# EAGLE schematic Stencil Test (EAGLE 6.6.0)
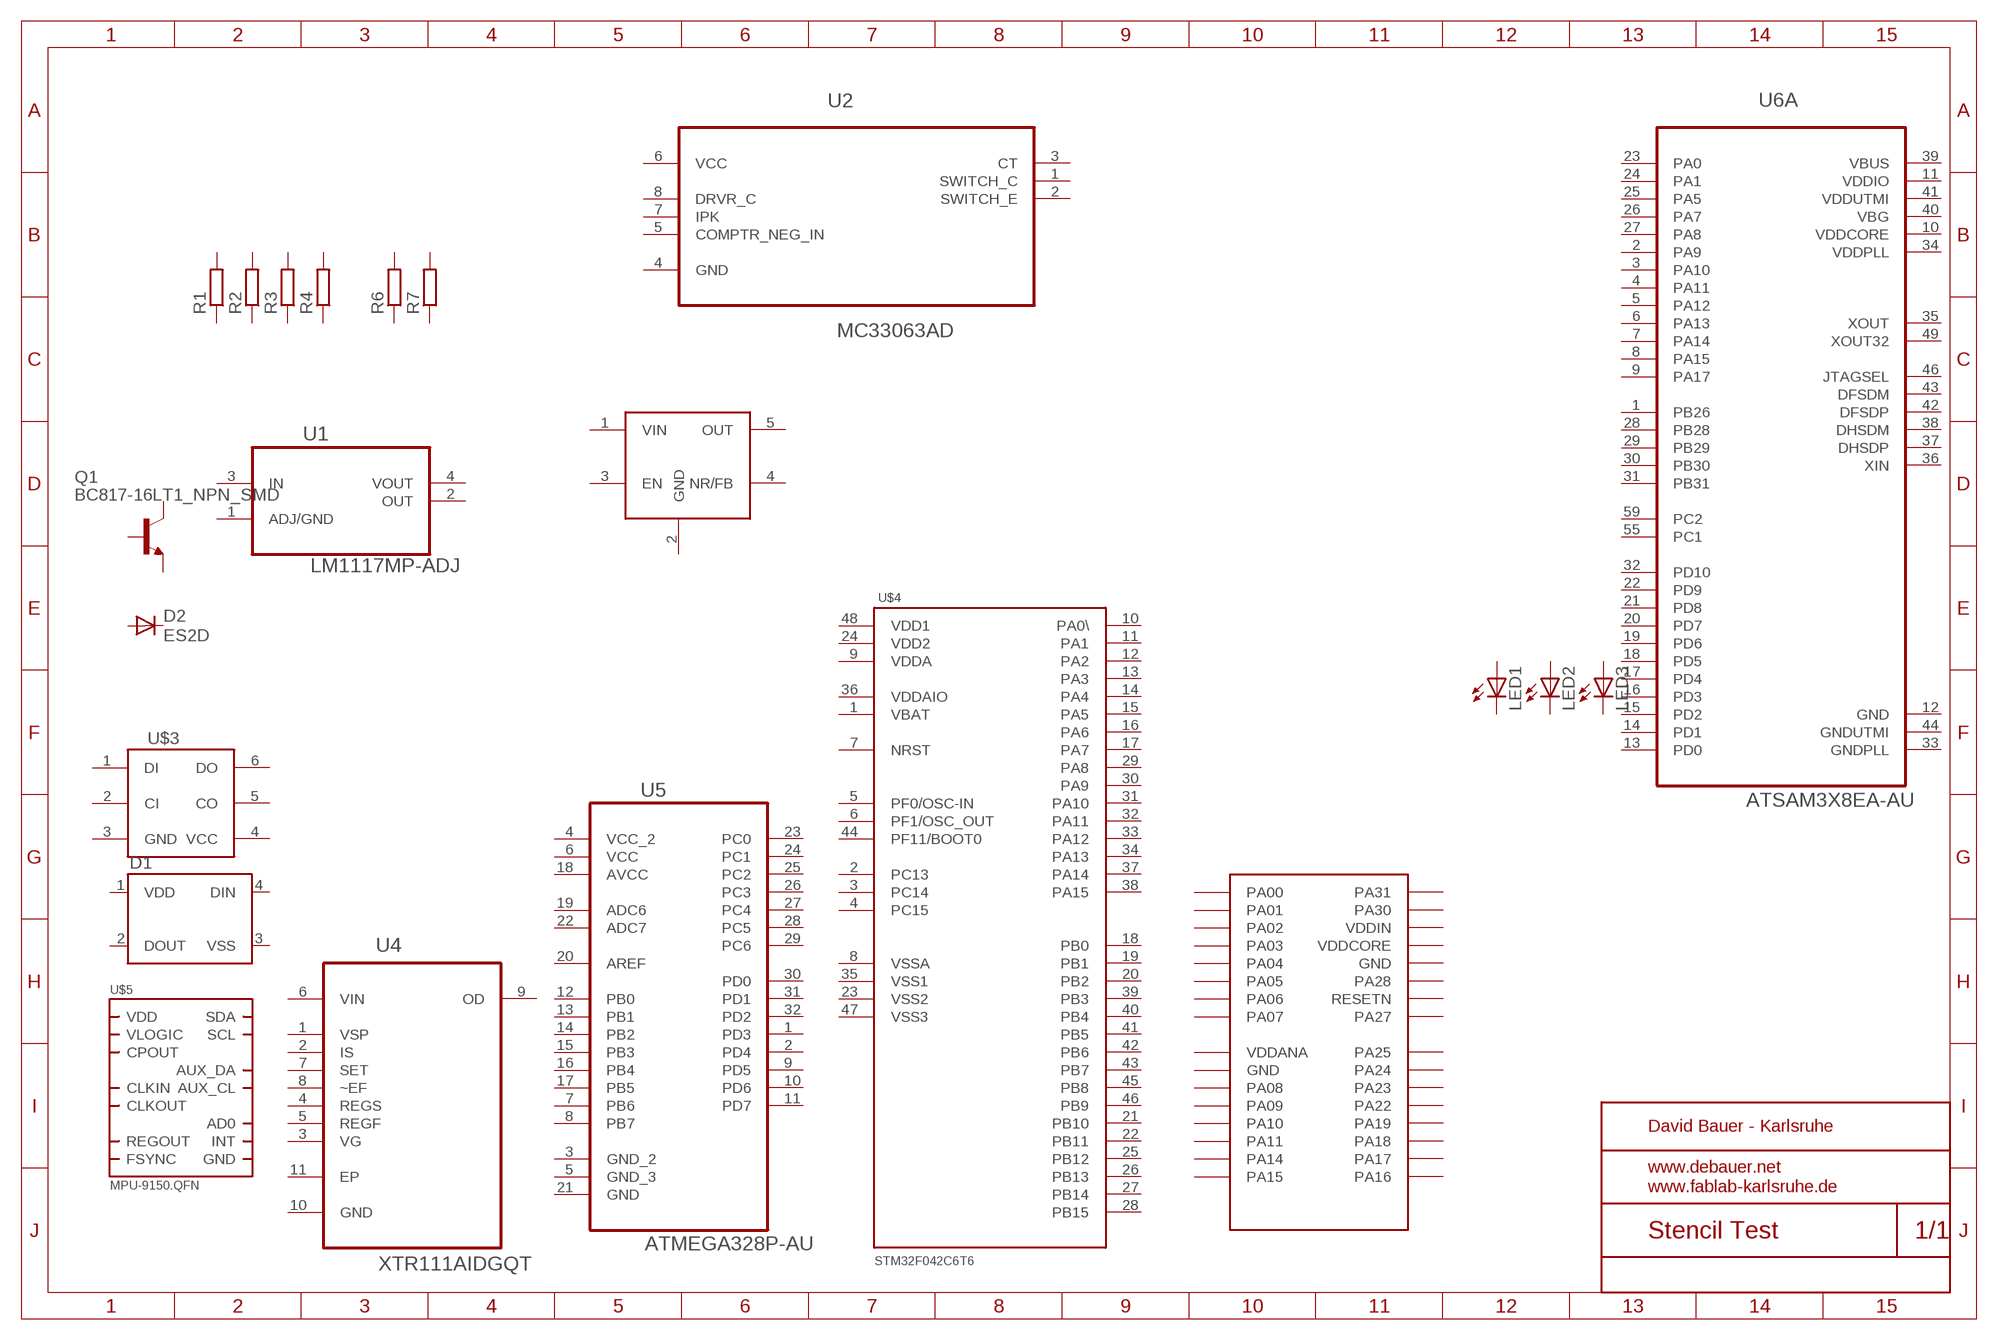
[diagram p0: schematic, sheet 1]

## Parts
D1  WS2812B  [WS2812B]
D2  ES2D  [SMB]
LED1  LEDCHIPLED_0603  [CHIPLED_0603]
LED2  LEDCHIPLED_0805  [CHIPLED_0805]
LED3  LEDCHIPLED_1206  [CHIPLED_1206]
Q1  BC817-16LT1_NPN_SMD  [SOT23-BEC]
R1  R-EU_R0402  [R0402]
R2  R-EU_R0603  [R0603]
R3  R-EU_R0805  [R0805]
R4  R-EU_R0805W  [R0805W]
R6  R-EU_R1206  [R1206]
R7  R-EU_R1206W  [R1206W]
U1  LM1117MP-ADJ  [SOT230P696X180-4N]
U2  MC33063AD  [SOIC127P600X175-8N]
U4  XTR111AIDGQT  [SOP50P490X120-15N]
U5  ATMEGA328P-AU  [QFP80P900X900X120-32N]
U6  ATSAM3X8EA-AU  [QFP50P2200X2200X145-144N]
U$2  TPS73133  [SOT23-5L]
U$3  APA102  [LED5050]
U$4  STM32F042C6T6  [LQFP48]
U$5  MPU-9150.QFN  [QFN.24.4X4]
U$6  ATSAMD21E18A-MUT  [QFN32]
Unconnected: D1.2(DOUT) D1.4(DIN) D2.A D2.C LED1.A LED1.C LED2.A LED2.C LED3.A LED3.C Q1.B Q1.C Q1.E R1.1 R1.2 R2.1 R2.2 R3.1 R3.2 R4.1 R4.2 R6.1 R6.2 R7.1 R7.2 U1.1(ADJ/GND) U1.2(OUT) U1.3(IN) U1.4(VOUT) U2.1(SWITCH_C) U2.2(SWITCH_E) U2.3(CT) U2.4(GND) U2.5(COMPTR_NEG_IN) U2.7(IPK) U2.8(DRVR_C) U4.2(IS) U4.3(VG) U4.4(REGS) U4.5(REGF) U4.6(VIN) U4.7(SET) U4.8(~EF) U4.9(OD) U4.10(GND) U4.11(EP) U5.1(PD3) U5.2(PD4) U5.3(GND_2) U5.5(GND_3) U5.7(PB6) U5.8(PB7) U5.9(PD5) U5.10(PD6) U5.11(PD7) U5.12(PB0) U5.13(PB1) U5.14(PB2) U5.15(PB3) U5.16(PB4) U5.17(PB5) U5.19(ADC6) U5.20(AREF) U5.21(GND) U5.22(ADC7) U5.23(PC0) U5.24(PC1) U5.25(PC2) U5.26(PC3) U5.27(PC4) U5.28(PC5) U5.29(PC6) U5.30(PD0) U5.31(PD1) U5.32(PD2) U6.1(A:PB26) U6.2(A:PA9) U6.3(A:PA10) U6.4(A:PA11) U6.5(A:PA12) U6.6(A:PA13) U6.7(A:PA14) U6.8(A:PA15) U6.9(A:PA17) U6.12(A:GND) U6.13(A:PD0) U6.14(A:PD1) U6.15(A:PD2) U6.16(A:PD3) U6.17(A:PD4) U6.18(A:PD5) U6.19(A:PD6) U6.20(A:PD7) U6.21(A:PD8) U6.22(A:PD9) U6.23(A:PA0) U6.24(A:PA1) U6.25(A:PA5) U6.26(A:PA7) U6.27(A:PA8) U6.28(A:PB28) U6.29(A:PB29) U6.30(A:PB30) U6.31(A:PB31) U6.32(A:PD10) U6.33(A:GNDPLL) U6.35(A:XOUT) U6.36(A:XIN) U6.37(A:DHSDP) U6.38(A:DHSDM) U6.39(A:VBUS) U6.42(A:DFSDP) U6.43(A:DFSDM) U6.44(A:GNDUTMI) U6.46(A:JTAGSEL) U6.47(B:NRSTB) U6.48(B:XIN32) U6.49(A:XOUT32) U6.50(B:SHDN) U6.51(C:TST) U6.53(C:FWUP) U6.54(B:GNDBU) U6.55(A:PC1) U6.58(B:GND) U6.59(A:PC2) U6.60(B:PC3) U6.63(B:PC5) U6.64(B:PC6) U6.65(B:PC7) U6.66(B:PC8) U6.67(B:PC9) U6.68(B:PB27) U6.69(B:NRST) U6.70(B:PA18) U6.71(B:PA19) U6.72(B:PA20) U6.74(B:GNDANA) U6.75(C:ADVREF) U6.76(B:PB15) U6.77(B:PB16) U6.78(B:PA16) U6.79(B:PA24) U6.80(B:PA23) U6.81(B:PA22) U6.82(B:PA6) U6.83(B:PA4) U6.84(B:PA3) U6.85(B:PA2) U6.86(B:PB12) U6.87(B:PB13) U6.88(B:PB17) U6.89(B:PB18) U6.90(B:PB19) U6.91(B:PB20) U6.92(B:PB21) U6.93(B:PC11) U6.94(B:PC12) U6.95(B:PC13) U6.96(B:PC14) U6.97(B:PC15) U6.98(B:PC16) U6.99(B:PC17) U6.100(B:PC18) U6.101(C:PC19) U6.102(C:PC29) U6.103(C:PC30) U6.106(C:GND_2) U6.107(C:PA21) U6.108(C:PA25) U6.109(C:PA26) U6.110(C:PA27) U6.111(C:PA28) U6.112(C:PA29) U6.113(C:PB0) U6.114(C:PB1) U6.115(C:PB2) U6.116(C:PC4) U6.117(C:PC10) U6.118(C:PB3) U6.119(C:PB4) U6.120(C:PB5) U6.121(C:PB6) U6.122(C:PB7) U6.123(C:PB8) U6.126(C:GND) U6.127(C:PB9) U6.128(C:PB10) U6.129(C:PB11) U6.130(C:PC0) U6.131(C:PC20) U6.132(C:PC21) U6.133(C:PC22) U6.134(C:PC23) U6.135(C:PC24) U6.136(C:PC25) U6.137(C:PC26) U6.138(C:PC27) U6.139(C:PC28) U6.140(C:PB14) U6.141(C:PB22) U6.142(C:PB23) U6.143(C:PB24) U6.144(C:PB25) U$2.1(VIN) U$2.2(GND) U$2.3(EN) U$2.4(NR/FB) U$2.5(OUT) U$3.1(DI) U$3.2(CI) U$3.3(GND) U$3.4(VCC) U$3.5(CO) U$3.6(DO) U$4.1(VBAT) U$4.2(PC13) U$4.3(PC14) U$4.4(PC15) U$4.5(PF0/OSC-IN) U$4.6(PF1/OSC_OUT) U$4.7(NRST) U$4.8(VSSA) U$4.9(VDDA) U$4.10(PA0\) U$4.11(PA1) U$4.12(PA2) U$4.13(PA3) U$4.14(PA4) U$4.15(PA5) U$4.16(PA6) U$4.17(PA7) U$4.18(PB0) U$4.19(PB1) U$4.20(PB2) U$4.21(PB10) U$4.22(PB11) U$4.23(VSS2) U$4.24(VDD2) U$4.25(PB12) U$4.26(PB13) U$4.27(PB14) U$4.28(PB15) U$4.29(PA8) U$4.30(PA9) U$4.31(PA10) U$4.32(PA11) U$4.33(PA12) U$4.34(PA13) U$4.35(VSS1) U$4.36(VDDAIO) U$4.37(PA14) U$4.38(PA15) U$4.39(PB3) U$4.40(PB4) U$4.41(PB5) U$4.42(PB6) U$4.43(PB7) U$4.44(PF11/BOOT0) U$4.45(PB8) U$4.46(PB9) U$4.47(VSS3) U$4.48(VDD1) U$5.1(CLKIN) U$5.3(VDD) U$5.6(AUX_DA) U$5.7(AUX_CL) U$5.8(VLOGIC) U$5.9(AD0) U$5.10(REGOUT) U$5.11(FSYNC) U$5.12(INT) U$5.13(VDD) U$5.15(GND) U$5.17(GND) U$5.18(GND) U$5.20(CPOUT) U$5.22(CLKOUT) U$5.23(SCL) U$5.24(SDA) U$6.1(PA00) U$6.2(PA01) U$6.3(PA02) U$6.4(PA03) U$6.5(PA04) U$6.6(PA05) U$6.7(PA06) U$6.8(PA07) U$6.9(VDDANA) U$6.10(GND) U$6.11(PA08) U$6.12(PA09) U$6.13(PA10) U$6.14(PA11) U$6.15(PA14) U$6.16(PA15) U$6.17(PA16) U$6.18(PA17) U$6.19(PA18) U$6.20(PA19) U$6.21(PA22) U$6.22(PA23) U$6.23(PA24) U$6.24(PA25) U$6.25(PA27) U$6.26(RESETN) U$6.27(PA28) U$6.28(GND) U$6.29(VDDCORE) U$6.30(VDDIN) U$6.31(PA30) U$6.32(PA31)

## Power pins joined to a net without a drawn wire
AVCC: U5.18(AVCC)
VBG: U6.40(A:VBG)
VCC: U2.6(VCC) U5.6(VCC)
VCC_2: U5.4(VCC_2)
VDD: D1.1(VDD)
VDDANA: U6.73(C:VDDANA)
VDDBU: U6.52(B:VDDBU)
VDDCORE: U6.10(A:VDDCORE) U6.45(B:VDDCORE) U6.124(C:VDDCORE)
VDDCORE_2: U6.61(B:VDDCORE_2) U6.104(C:VDDCORE_2)
VDDIN: U6.57(B:VDDIN)
VDDIO: U6.11(A:VDDIO) U6.62(B:VDDIO) U6.125(C:VDDIO)
VDDIO_2: U6.105(C:VDDIO_2)
VDDOUT: U6.56(B:VDDOUT)
VDDPLL: U6.34(A:VDDPLL)
VDDUTMI: U6.41(A:VDDUTMI)
VSP: U4.1(VSP)
VSS: D1.3(VSS)

## Library data of the parts
D1 = debauer_led:WS2812B: WS2812B - Intelligent control LED integrated light source Technical Specifications: Power Supply Voltage (VDD): 3.5 to 5.3 V Input Voltage (VI): -0.5 to VDD+0.5 V Operating Junction Temperature (Topt): -25°C to +80°C Storage Temperature Range (Tstg): -55°C to +150°C; PROD_ID: DIO-12503
D2 = debauer_dioden:ES2D: DIODE super fast rectifier, 2 A; MPN: ES2D; OC_ELBE: 01.41.0013.0; OC_FARNELL: 1625037; SUPPLIER: Multicomp
LED1-LED3 = adafruit:LED: LED OSRAM: - CHIPLED LG R971, LG N971, LY N971, LG Q971, LY Q971, LO R971, LY R971 LH N974, LH R974 LS Q976, LO Q976, LY Q976 LO Q996 - Hyper CHIPLED LW Q18S LB Q993, LB Q99A, LB R99A - SideLED LS A670, LO A670, LY A670, LG A670, LP A670 LB A673, LV A673, LT A673, LW A673 LH A674 LY A675 LS A676, LA A676, LO A676, LY A676, LW A676 LS A679, LY A679, LG A679 - Hyper Micro SIDELED® LS Y876, LA Y876, LO Y876, LY Y876 LT Y87S - SmartLED LW L88C, LW L88S LB L89C, LB L89S, LG L890 LS L89K, LO L89K, LY L89K LS L896, LA L896, LO L896, LY L896 - TOPLED LS T670, LO T670, LY T670, LG T670, LP T670 LSG T670, LSP T670, LSY T670, LOP T670, LYG T670 LG T671, LOG T671, LSG T671 LB T673, LV T673, LT T673, LW T673 LH T674 LS T676, LA T676, LO T676, LY T676, LB T676, LH T676, LSB T676, LW T676 LB T67C, LV T67C, LT T67C, LS T67K, LO T67K, LY T67K, LW E67C LS E67B, LA E67B, LO E67B, LY E67B, LB E67C, LV E67C, LT E67C LW T67C LS T679, LY T679, LG T679 LS T770, LO T770, LY T770, LG T770, LP T770 LB T773, LV T773, LT T773, LW T773 LH T774 LS E675, LA E675, LY E675, LS T675 LS T776, LA T776, LO T776, LY T776, LB T776 LHGB T686 LT T68C, LB T68C - Hyper Mini TOPLED® LB M676 - Mini TOPLED Santana® LG M470 LS M47K, LO M47K, LY M47K Source: http://www.osram.convergy.de/
Q1 = debauer_transistor:BC817*: NPN Transistor; MPN: BC817-16LT1
R1-R4 R6 R7 = debauer_passiv:R-EU_: RESISTOR, European symbol
U1 = debauer_reg:LM1117MP-ADJ: Linear regulators; MPN: LM1117MP-ADJ; OC_FARNELL: 9778187; OC_NEWARK: 13B5337; PACKAGE: SOT223-3; SUPPLIER: NationalSemiconductor
U2 = debauer_reg:MC33063AD: REGULATORS; MPN: MC33063AD; OC_FARNELL: 1053591; OC_NEWARK: 05M4209; PACKAGE: SOIC-8; SUPPLIER: TI
U4 = debauer_ics:XTR111AIDGQT: Precision Voltage-to-Current Converter/Transmitter; MPN: XTR111AIDGQT; OC_FARNELL: 1703441; OC_NEWARK: 54M7931; PACKAGE: MSOP-10; SUPPLIER: TEXAS INSTRUMENTS
U5 = debauer_ics:ATMEGA328P-AU: 8-bit Microcontroller with In-System Programmable Flash; MPN: ATMEGA328P-AU; OC_FARNELL: 1715486; OC_NEWARK: 14R4631; PACKAGE: TQFP-32; SUPPLIER: Atmel
U6 = debauer_ics:ATSAM3X8EA-AU: IC, MCU, CORTEX M3, 84MHZ, LQFP-144; MOUNT: smd; MPN: ATSAM3X8EA-AU; OC_FARNELL: 2318839; OC_NEWARK: 92T0815; PACKAGE: LQFP-144; SUPPLIER: ATMEL
U$2 = debauer_reg:TPS73133
U$3 = debauer_led:APA102
U$4 = debauer_ics:STM32F042C6T6
U$5 = debauer_ics:MPU-9150
U$6 = debauer_ics:ATSAMD21E18A-MUT: This is the ATMEL SAMD21E QFN-32. ATSAMD21E18A

## Net classes
4 USBpair: width 0.254 mm, drill 0.406 mm, clearance 0.508 mm